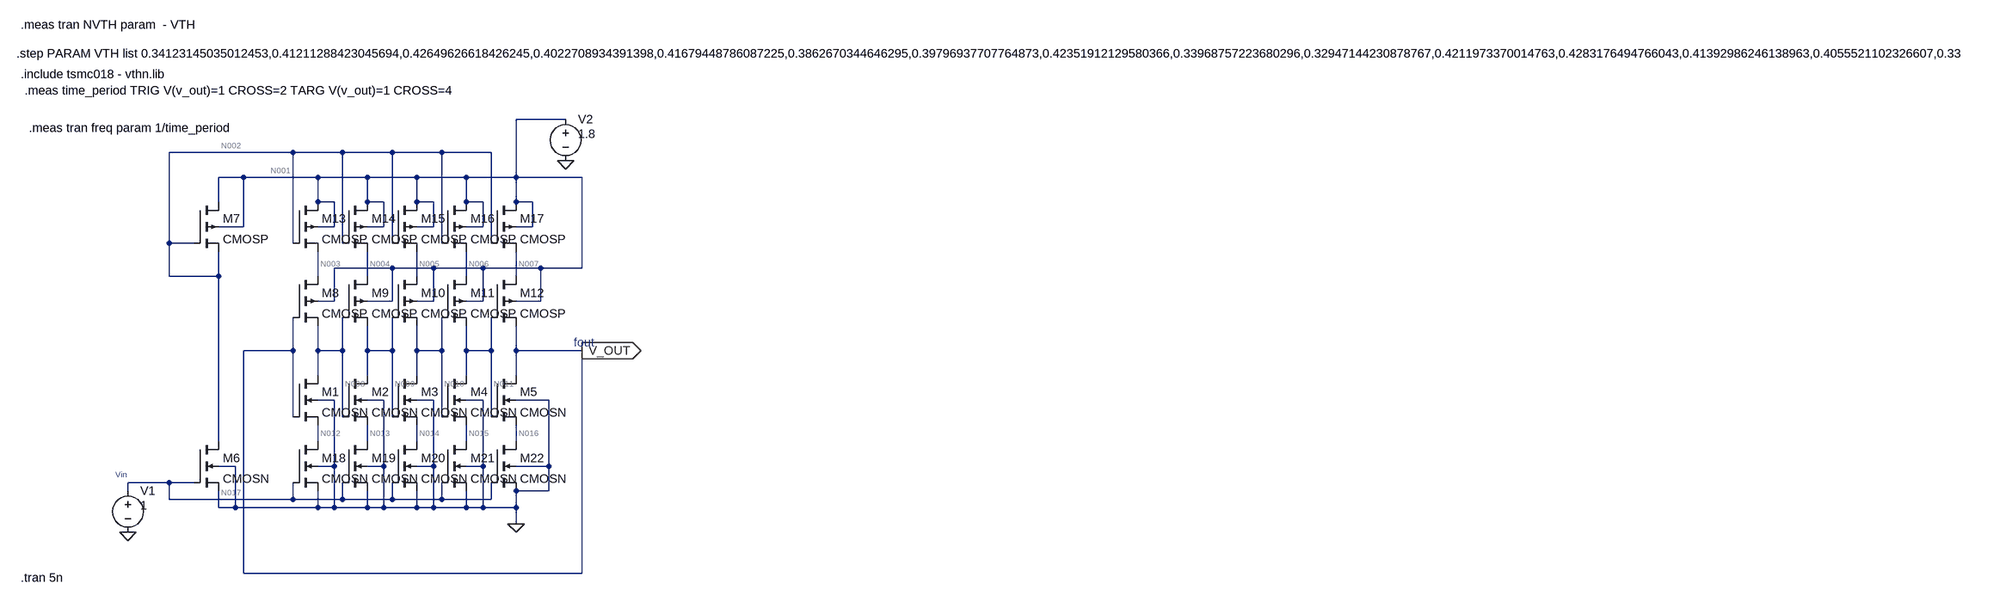
[diagram p0: schematic VCO_final.asc]
VCO_final.asc, the LTspice schematic file:
Version 4
SHEET 1 60540 720
WIRE 512 -288 416 -288
WIRE -16 -224 -256 -224
WIRE 80 -224 -16 -224
WIRE 176 -224 80 -224
WIRE 272 -224 176 -224
WIRE 368 -224 272 -224
WIRE -112 -176 -160 -176
WIRE 32 -176 -112 -176
WIRE 128 -176 32 -176
WIRE 224 -176 128 -176
WIRE 320 -176 224 -176
WIRE 416 -176 416 -288
WIRE 416 -176 320 -176
WIRE 544 -176 416 -176
WIRE -160 -128 -160 -176
WIRE 32 -128 32 -176
WIRE 64 -128 32 -128
WIRE 128 -128 128 -176
WIRE 160 -128 128 -128
WIRE 224 -128 224 -176
WIRE 256 -128 224 -128
WIRE 320 -128 320 -176
WIRE 352 -128 320 -128
WIRE 416 -128 416 -176
WIRE 448 -128 416 -128
WIRE -112 -80 -112 -176
WIRE -112 -80 -160 -80
WIRE 64 -80 64 -128
WIRE 64 -80 32 -80
WIRE 160 -80 160 -128
WIRE 160 -80 128 -80
WIRE 256 -80 256 -128
WIRE 256 -80 224 -80
WIRE 352 -80 352 -128
WIRE 352 -80 320 -80
WIRE 448 -80 448 -128
WIRE 448 -80 416 -80
WIRE -256 -48 -256 -224
WIRE -208 -48 -256 -48
WIRE -16 -48 -16 -224
WIRE 80 -48 80 -224
WIRE 176 -48 176 -224
WIRE 272 -48 272 -224
WIRE 368 -48 368 -224
WIRE 176 0 64 0
WIRE 256 0 176 0
WIRE 352 0 256 0
WIRE 464 0 352 0
WIRE 544 0 544 -176
WIRE 544 0 464 0
WIRE -256 16 -256 -48
WIRE -160 16 -160 -32
WIRE -160 16 -256 16
WIRE 32 16 32 -32
WIRE 128 16 128 -32
WIRE 224 16 224 -32
WIRE 320 16 320 -32
WIRE 416 16 416 -32
WIRE 64 64 64 0
WIRE 64 64 32 64
WIRE 176 64 176 0
WIRE 176 64 128 64
WIRE 256 64 256 0
WIRE 256 64 224 64
WIRE 352 64 352 0
WIRE 352 64 320 64
WIRE 464 64 464 0
WIRE 464 64 416 64
WIRE -16 160 -16 96
WIRE -16 160 -112 160
WIRE 32 160 32 112
WIRE 80 160 80 96
WIRE 80 160 32 160
WIRE 128 160 128 112
WIRE 176 160 176 96
WIRE 176 160 128 160
WIRE 224 160 224 112
WIRE 272 160 272 96
WIRE 272 160 224 160
WIRE 320 160 320 112
WIRE 368 160 368 96
WIRE 368 160 320 160
WIRE 416 160 416 112
WIRE 544 160 416 160
WIRE 32 208 32 160
WIRE 128 208 128 160
WIRE 224 208 224 160
WIRE 320 208 320 160
WIRE 416 208 416 160
WIRE 64 256 32 256
WIRE 160 256 128 256
WIRE 256 256 224 256
WIRE 352 256 320 256
WIRE 480 256 416 256
WIRE -16 288 -16 160
WIRE 80 288 80 160
WIRE 176 288 176 160
WIRE 272 288 272 160
WIRE 368 288 368 160
WIRE -160 336 -160 16
WIRE 32 336 32 304
WIRE 128 336 128 304
WIRE 224 336 224 304
WIRE 320 336 320 304
WIRE 416 336 416 304
WIRE -128 384 -160 384
WIRE 64 384 64 256
WIRE 64 384 32 384
WIRE 160 384 160 256
WIRE 160 384 128 384
WIRE 256 384 256 256
WIRE 256 384 224 384
WIRE 352 384 352 256
WIRE 352 384 320 384
WIRE 480 384 480 256
WIRE 480 384 416 384
WIRE -256 416 -336 416
WIRE -208 416 -256 416
WIRE -336 432 -336 416
WIRE 480 432 480 384
WIRE 480 432 416 432
WIRE -256 448 -256 416
WIRE -16 448 -16 416
WIRE -16 448 -256 448
WIRE 80 448 80 416
WIRE 80 448 -16 448
WIRE 176 448 176 416
WIRE 176 448 80 448
WIRE 272 448 272 416
WIRE 272 448 176 448
WIRE 368 448 368 416
WIRE 368 448 272 448
WIRE -160 464 -160 432
WIRE -128 464 -128 384
WIRE -128 464 -160 464
WIRE 32 464 32 432
WIRE 32 464 -128 464
WIRE 64 464 64 384
WIRE 64 464 32 464
WIRE 128 464 128 432
WIRE 128 464 64 464
WIRE 160 464 160 384
WIRE 160 464 128 464
WIRE 224 464 224 432
WIRE 224 464 160 464
WIRE 256 464 256 384
WIRE 256 464 224 464
WIRE 320 464 320 432
WIRE 320 464 256 464
WIRE 352 464 352 384
WIRE 352 464 320 464
WIRE 416 464 416 432
WIRE 416 464 352 464
WIRE 416 496 416 464
WIRE -112 592 -112 160
WIRE 544 592 544 160
WIRE 544 592 -112 592
FLAG 416 496 0
FLAG -336 512 0
FLAG 512 -208 0
FLAG 544 160 V_OUT
IOPIN 544 160 Out
SYMBOL cmosn -16 208 R0
SYMATTR InstName M1
SYMATTR Value2 l=180n w=400n
SYMBOL cmosn 80 208 R0
SYMATTR InstName M2
SYMATTR Value2 l=180n w=400n
SYMBOL cmosn 176 208 R0
SYMATTR InstName M3
SYMATTR Value2 l=180n w=400n
SYMBOL cmosn 272 208 R0
SYMATTR InstName M4
SYMATTR Value2 l=180n w=400n
SYMBOL cmosn 368 208 R0
SYMATTR InstName M5
SYMATTR Value2 l=180n w=400n
SYMBOL cmosn -208 336 R0
SYMATTR InstName M6
SYMATTR Value2 l=180n w=400n
SYMBOL cmosp -208 -128 R0
SYMATTR InstName M7
SYMATTR Value2 l=180n w=720n
SYMBOL cmosp -16 16 R0
SYMATTR InstName M8
SYMATTR Value2 l=180n w=720n
SYMBOL cmosp 80 16 R0
SYMATTR InstName M9
SYMATTR Value2 l=180n w=720n
SYMBOL cmosp 176 16 R0
SYMATTR InstName M10
SYMATTR Value2 l=180n w=720n
SYMBOL cmosp 272 16 R0
SYMATTR InstName M11
SYMATTR Value2 l=180n w=720n
SYMBOL cmosp 368 16 R0
SYMATTR InstName M12
SYMATTR Value2 l=180n w=720n
SYMBOL cmosp -16 -128 R0
SYMATTR InstName M13
SYMATTR Value2 l=180n w=720n
SYMBOL cmosp 80 -128 R0
SYMATTR InstName M14
SYMATTR Value2 l=180n w=720n
SYMBOL cmosp 176 -128 R0
SYMATTR InstName M15
SYMATTR Value2 l=180n w=720n
SYMBOL cmosp 272 -128 R0
SYMATTR InstName M16
SYMATTR Value2 l=180n w=720n
SYMBOL cmosp 368 -128 R0
SYMATTR InstName M17
SYMATTR Value2 l=180n w=720n
SYMBOL cmosn -16 336 R0
SYMATTR InstName M18
SYMATTR Value2 l=180n w=400n
SYMBOL cmosn 80 336 R0
SYMATTR InstName M19
SYMATTR Value2 l=180n w=400n
SYMBOL cmosn 176 336 R0
SYMATTR InstName M20
SYMATTR Value2 l=180n w=400n
SYMBOL cmosn 272 336 R0
SYMATTR InstName M21
SYMATTR Value2 l=180n w=400n
SYMBOL cmosn 368 336 R0
SYMATTR InstName M22
SYMATTR Value2 l=180n w=400n
SYMBOL voltage -336 416 R0
WINDOW 123 0 0 Left 0
WINDOW 39 0 0 Left 0
WINDOW 3 24 44 Left 2
SYMATTR Value 1
SYMATTR InstName V1
SYMBOL voltage 512 -304 R0
WINDOW 123 0 0 Left 0
WINDOW 39 0 0 Left 0
WINDOW 3 24 44 Left 2
SYMATTR Value 1.8
SYMATTR InstName V2
TEXT -360 400 Left 1 ;Vin
TEXT -544 -376 Left 2 !.include tsmc018 - vthn.lib
TEXT 528 144 Left 2 ;fout
TEXT -544 600 Left 2 !.tran 5n
TEXT -536 -344 Left 2 !.meas time_period TRIG V(v_out)=1 CROSS=2 TARG V(v_out)=1 CROSS=4
TEXT -528 -272 Left 2 !.meas tran freq param 1/time_period
TEXT -552 -416 Left 2 !.step PARAM VTH list 0.34123145035012453,0.41211288423045694,0.42649626618426245,0.4022708934391398,0.41679448786087225,0.3862670344646295,0.39796937707764873,0.42351912129580366,0.33968757223680296,0.32947144230878767,0.4211973370014763,0.4283176494766043,0.41392986246138963,0.4055521102326607,0.3344496518028196,0.3657123658260539,0.34614992494358454,0.3964107297443898,0.41024549929109094,0.3648597717710239,0.34522579887786636,0.404847386598565,0.37460345053578714,0.42921464622789285,0.3772612651016478,0.4161702052802685,0.36600139049304814,0.41908511931473874,0.40927036845522574,0.3631414978111844,0.348054698184029,0.3558470532014468,0.43816164310341166,0.43904430614803064,0.3920947131348672,0.43576638461181516,0.3725080336835615,0.4105138459687793,0.35863793990781917,0.4423548387084376,0.42070040486412613,0.3674810891098386,0.41314563117988473,0.40219142324970547,0.39721959746376534,0.41184450646851484,0.3529392884662512,0.39939314953899596,0.3764285631359052,0.42469374750574496,0.38628267011991163,0.4430167249331012,0.33727633609166197,0.41343349153926306,0.35148275458146505,0.4001497092096314,0.4713983979675836,0.38135091221781425,0.3723307534587298,0.37301852708525574,0.33320564019381643,0.4102736127128648,0.3184868129197651,0.3833000598738273,0.45643126076383045,0.405794505600391,0.3936318548533926,0.463109531846861,0.46249498340604484,0.3762165369904304,0.37688124433454795,0.4011519754923409,0.37765600990409953,0.43681384689065056,0.4255514089770617,0.45256370497813914,0.4166905175462833,0.3368445789803969,0.3924425163729591,0.43620625444145833,0.3815431335926527,0.32485246910000376,0.37238436652416246,0.4197542600307912,0.37382602326897474,0.423340221221321,0.3837018101919968,0.39051683308038254,0.4532311036347836,0.39662051199745296,0.40124538404153315,0.4086491032540003,0.3688441243631652,0.4325105480018463,0.39677801399992074,0.4112788463423556,0.4944176386371289,0.3749279344176446,0.3080620381482138,0.36518813592270644,0.42471037451196114,0.38487323328131895,0.35232562759257263,0.420358414656914,0.38418245693136804,0.3611101564381721,0.49107852153747544,0.37177656798760156,0.3804654123151989,0.3660581763651771,0.42128526051740606,0.38548177025650804,0.34387803352337165,0.45404984689034716,0.4222415081737018,0.4313853194269319,0.3554055479435352,0.36851148978690307,0.4171475638855737,0.37098037028639763,0.34476902249925784,0.3977539477988256,0.3479771662452767,0.4358790657900633,0.4144323581835056,0.3538197319094376,0.4131307279731286,0.41528962138818953,0.40632022359474024,0.44035433986726663,0.3650305759067878,0.35408169191803424,0.40641080008659336,0.3725902793941234,0.40759294263324086,0.4562114387339081,0.4078138915212504,0.3981679488532111,0.4063669183272805,0.39781852353741376,0.39575882256583134,0.42809945732132265,0.3959886146373276,0.3589556374780292,0.35091671925222384,0.41728146173695546,0.3542802170682952,0.3908407828604423,0.3760077333557209,0.40628197349912426,0.3839458277006042,0.38946649047323556,0.39540742123569467,0.40251430666052873,0.3797940165578701,0.43308684158186495,0.2778500785714441,0.37223399650821487,0.37503460256099835,0.3983597932957826,0.4216801084842382,0.3352102821653071,0.41503155510277,0.37344480560627136,0.4238235964857379,0.3921225278547601,0.3964489812498269,0.33806797341778916,0.3918770429000265,0.4997326545299706,0.3780714823066963,0.347517731873477,0.397169569671728,0.34822611939145465,0.41336025516607655,0.4552249514742054,0.45621058556221405,0.3896944750691362,0.36600044168859097,0.4287016626999486,0.4271690708099927,0.40501562810085107,0.401577427651368,0.42823651486995584,0.35121895394048347,0.37177467869890624,0.3372763927011097,0.4001796243790737,0.41495924616882346,0.4291356450453868,0.33600135197395603,0.3248539043657599,0.39957084242810414,0.3965284910215623,0.3958331478953597,0.4058255506685828,0.42740318040180236,0.3629473429174722,0.4413177749838848,0.3510178966466979
TEXT -544 -472 Left 2 !.meas tran NVTH param  - VTH

The netlist it stands for:
* VCO_final.asc
M1 N008 V_OUT N012 0 CMOSN l=180n w=400n
M2 N009 N008 N013 0 CMOSN l=180n w=400n
M3 N010 N009 N014 0 CMOSN l=180n w=400n
M4 N011 N010 N015 0 CMOSN l=180n w=400n
M5 V_OUT N011 N016 0 CMOSN l=180n w=400n
M6 N002 N017 0 0 CMOSN l=180n w=400n
M7 N001 N002 N002 N001 CMOSP l=180n w=720n
M8 N003 V_OUT N008 N001 CMOSP l=180n w=720n
M9 N004 N008 N009 N001 CMOSP l=180n w=720n
M10 N005 N009 N010 N001 CMOSP l=180n w=720n
M11 N006 N010 N011 N001 CMOSP l=180n w=720n
M12 N007 N011 V_OUT N001 CMOSP l=180n w=720n
M13 N001 N002 N003 N001 CMOSP l=180n w=720n
M14 N001 N002 N004 N001 CMOSP l=180n w=720n
M15 N001 N002 N005 N001 CMOSP l=180n w=720n
M16 N001 N002 N006 N001 CMOSP l=180n w=720n
M17 N001 N002 N007 N001 CMOSP l=180n w=720n
M18 N012 N017 0 0 CMOSN l=180n w=400n
M19 N013 N017 0 0 CMOSN l=180n w=400n
M20 N014 N017 0 0 CMOSN l=180n w=400n
M21 N015 N017 0 0 CMOSN l=180n w=400n
M22 N016 N017 0 0 CMOSN l=180n w=400n
V1 N017 0 1
V2 N001 0 1.8
.model NMOS NMOS
.model PMOS PMOS
.lib standard.mos
* Vin
.include tsmc018 - vthn.lib
* fout
.tran 5n
.meas time_period TRIG V(v_out)=1 CROSS=2 TARG V(v_out)=1 CROSS=4
.meas tran freq param 1/time_period
.step PARAM VTH list 0.34123145035012453,0.41211288423045694,0.42649626618426245,0.4022708934391398,0.41679448786087225,0.3862670344646295,0.39796937707764873,0.42351912129580366,0.33968757223680296,0.32947144230878767,0.4211973370014763,0.4283176494766043,0.41392986246138963,0.4055521102326607,0.3344496518028196,0.3657123658260539,0.34614992494358454,0.3964107297443898,0.41024549929109094,0.3648597717710239,0.34522579887786636,0.404847386598565,0.37460345053578714,0.42921464622789285,0.3772612651016478,0.4161702052802685,0.36600139049304814,0.41908511931473874,0.40927036845522574,0.3631414978111844,0.348054698184029,0.3558470532014468,0.43816164310341166,0.43904430614803064,0.3920947131348672,0.43576638461181516,0.3725080336835615,0.4105138459687793,0.35863793990781917,0.4423548387084376,0.42070040486412613,0.3674810891098386,0.41314563117988473,0.40219142324970547,0.39721959746376534,0.41184450646851484,0.3529392884662512,0.39939314953899596,0.3764285631359052,0.42469374750574496,0.38628267011991163,0.4430167249331012,0.33727633609166197,0.41343349153926306,0.35148275458146505,0.4001497092096314,0.4713983979675836,0.38135091221781425,0.3723307534587298,0.37301852708525574,0.33320564019381643,0.4102736127128648,0.3184868129197651,0.3833000598738273,0.45643126076383045,0.405794505600391,0.3936318548533926,0.463109531846861,0.46249498340604484,0.3762165369904304,0.37688124433454795,0.4011519754923409,0.37765600990409953,0.43681384689065056,0.4255514089770617,0.45256370497813914,0.4166905175462833,0.3368445789803969,0.3924425163729591,0.43620625444145833,0.3815431335926527,0.32485246910000376,0.37238436652416246,0.4197542600307912,0.37382602326897474,0.423340221221321,0.3837018101919968,0.39051683308038254,0.4532311036347836,0.39662051199745296,0.40124538404153315,0.4086491032540003,0.3688441243631652,0.4325105480018463,0.39677801399992074,0.4112788463423556,0.4944176386371289,0.3749279344176446,0.3080620381482138,0.36518813592270644,0.42471037451196114,0.38487323328131895,0.35232562759257263,0.420358414656914,0.38418245693136804,0.3611101564381721,0.49107852153747544,0.37177656798760156,0.3804654123151989,0.3660581763651771,0.42128526051740606,0.38548177025650804,0.34387803352337165,0.45404984689034716,0.4222415081737018,0.4313853194269319,0.3554055479435352,0.36851148978690307,0.4171475638855737,0.37098037028639763,0.34476902249925784,0.3977539477988256,0.3479771662452767,0.4358790657900633,0.4144323581835056,0.3538197319094376,0.4131307279731286,0.41528962138818953,0.40632022359474024,0.44035433986726663,0.3650305759067878,0.35408169191803424,0.40641080008659336,0.3725902793941234,0.40759294263324086,0.4562114387339081,0.4078138915212504,0.3981679488532111,0.4063669183272805,0.39781852353741376,0.39575882256583134,0.42809945732132265,0.3959886146373276,0.3589556374780292,0.35091671925222384,0.41728146173695546,0.3542802170682952,0.3908407828604423,0.3760077333557209,0.40628197349912426,0.3839458277006042,0.38946649047323556,0.39540742123569467,0.40251430666052873,0.3797940165578701,0.43308684158186495,0.2778500785714441,0.37223399650821487,0.37503460256099835,0.3983597932957826,0.4216801084842382,0.3352102821653071,0.41503155510277,0.37344480560627136,0.4238235964857379,0.3921225278547601,0.3964489812498269,0.33806797341778916,0.3918770429000265,0.4997326545299706,0.3780714823066963,0.347517731873477,0.397169569671728,0.34822611939145465,0.41336025516607655,0.4552249514742054,0.45621058556221405,0.3896944750691362,0.36600044168859097,0.4287016626999486,0.4271690708099927,0.40501562810085107,0.401577427651368,0.42823651486995584,0.35121895394048347,0.37177467869890624,0.3372763927011097,0.4001796243790737,0.41495924616882346,0.4291356450453868,0.33600135197395603,0.3248539043657599,0.39957084242810414,0.3965284910215623,0.3958331478953597,0.4058255506685828,0.42740318040180236,0.3629473429174722,0.4413177749838848,0.3510178966466979
.meas tran NVTH param  - VTH
.backanno
.end

* Results of the author's LTspice run, read from the files saved beside the schematic
* Operating Point (first step), zero values left out:
*   vth = 277.9 m
*   V(n008) = 719.8 mV
*   V(v_out) = 719.8 mV
*   V(n012) = 66.83 mV
*   V(n009) = 719.8 mV
*   V(n013) = 66.83 mV
*   V(n010) = 719.8 mV
*   V(n014) = 66.83 mV
*   V(n011) = 719.8 mV
*   V(n015) = 66.83 mV
*   V(n016) = 66.83 mV
*   V(n002) = 458.7 mV
*   V(n017) = 1 V
*   V(n001) = 1.8 V
*   V(n003) = 1.666 V
*   V(n004) = 1.666 V
*   V(n005) = 1.666 V
*   V(n006) = 1.666 V
*   V(n007) = 1.666 V
*   Id(M17) = 31.91 µA
*   Is(M17) = -31.91 µA
*   Id(M16) = 31.91 µA
*   Is(M16) = -31.91 µA
*   Id(M15) = 31.91 µA
*   Is(M15) = -31.91 µA
*   Id(M14) = 31.91 µA
*   Is(M14) = -31.91 µA
*   Id(M13) = 31.91 µA
*   Is(M13) = -31.91 µA
*   Id(M12) = 31.91 µA
*   Ib(M12) = 1.234 pA
*   Is(M12) = -31.91 µA
*   Id(M11) = 31.91 µA
*   Ib(M11) = 1.234 pA
*   Is(M11) = -31.91 µA
*   Id(M10) = 31.91 µA
*   Ib(M10) = 1.234 pA
*   Is(M10) = -31.91 µA
*   Id(M9) = 31.91 µA
*   Ib(M9) = 1.234 pA
*   Is(M9) = -31.91 µA
*   Id(M8) = 31.91 µA
*   Ib(M8) = 1.234 pA
*   Is(M8) = -31.91 µA
*   Id(M7) = 104.1 µA
*   Ib(M7) = 1.351 pA
*   Is(M7) = -104.1 µA
*   Id(M22) = 31.91 µA
*   Is(M22) = -31.91 µA
*   Id(M21) = 31.91 µA
*   Is(M21) = -31.91 µA
*   Id(M20) = 31.91 µA
*   Is(M20) = -31.91 µA
*   Id(M19) = 31.91 µA
*   Is(M19) = -31.91 µA
*   Id(M18) = 31.91 µA
*   Is(M18) = -31.91 µA
*   Id(M6) = 104.1 µA
*   Is(M6) = -104.1 µA
*   Id(M5) = 31.91 µA
*   Is(M5) = -31.91 µA
*   Id(M4) = 31.91 µA
*   Is(M4) = -31.91 µA
*   Id(M3) = 31.91 µA
*   Is(M3) = -31.91 µA
*   Id(M2) = 31.91 µA
*   Is(M2) = -31.91 µA
*   Id(M1) = 31.91 µA
*   Is(M1) = -31.91 µA
*   I(V2) = -263.7 µA
* From the log:
*   Measurement: time_period
*     step  time_period  FROM  TO
*        1  5.46032e-010  9.78402e-010  1.52443e-009
*        2  5.69848e-010  1.03753e-009  1.60738e-009
*        3  5.78819e-010  1.07638e-009  1.6552e-009
*        4  5.77069e-010  7.72967e-010  1.35004e-009
*        5  5.84495e-010  1.32978e-009  1.91427e-009
*        6  5.8872e-010  1.19882e-009  1.78754e-009
*        7  5.92215e-010  1.06871e-009  1.66093e-009
*        8  5.93346e-010  1.0246e-009  1.61795e-009
*        9  5.87665e-010  7.85811e-010  1.37348e-009
*       10  5.94871e-010  1.26643e-009  1.86131e-009
*       11  5.95672e-010  1.08781e-009  1.68349e-009
*       12  5.9609e-010  1.22202e-009  1.81811e-009
*       13  5.91925e-010  7.99111e-010  1.39104e-009
*       14  5.96841e-010  1.06324e-009  1.66008e-009
*       15  5.96316e-010  9.53593e-010  1.54991e-009
*       16  5.93485e-010  7.90638e-010  1.38412e-009
*       17  6.02508e-010  1.0649e-009  1.66741e-009
*       18  6.03405e-010  1.33913e-009  1.94253e-009
*       19  5.97413e-010  7.93841e-010  1.39125e-009
*       20  6.04763e-010  1.05631e-009  1.66107e-009
*       21  6.06153e-010  1.091e-009  1.69715e-009
*       22  5.99384e-010  7.92766e-010  1.39215e-009
*       23  6.06703e-010  1.07938e-009  1.68609e-009
*       24  6.06872e-010  1.09548e-009  1.70236e-009
*       25  6.09358e-010  1.00949e-009  1.61884e-009
*       26  6.09717e-010  1.37172e-009  1.98144e-009
*       27  6.09766e-010  1.01952e-009  1.62929e-009
*       28  6.10201e-010  1.35045e-009  1.96065e-009
*       29  6.11059e-010  1.28631e-009  1.89737e-009
*       30  6.11682e-010  1.11631e-009  1.72799e-009
*       31  6.12577e-010  1.06101e-009  1.67359e-009
*       32  6.12868e-010  1.08019e-009  1.69306e-009
*       33  6.03736e-010  7.83189e-010  1.38692e-009
*       34  6.14247e-010  1.0777e-009  1.69195e-009
*       35  6.14723e-010  1.34831e-009  1.96303e-009
*       36  6.08371e-010  7.90851e-010  1.39922e-009
*       37  6.15859e-010  8.32494e-010  1.44835e-009
*       38  6.13001e-010  8.03665e-010  1.41667e-009
*       39  6.19016e-010  8.26143e-010  1.44516e-009
*       40  6.17495e-010  8.15921e-010  1.43342e-009
*     ...
*   Measurement: freq
*     step  1/time_period
*        1  1.83139e+009
*        2  1.75486e+009
*        3  1.72766e+009
*        4  1.7329e+009
*        5  1.71088e+009
*        6  1.6986e+009
*        7  1.68857e+009
*        8  1.68536e+009
*        9  1.70165e+009
*       10  1.68104e+009
*       11  1.67878e+009
*       12  1.6776e+009
*       13  1.6894e+009
*       14  1.67549e+009
*       15  1.67696e+009
*       16  1.68496e+009
*       17  1.65973e+009
*       18  1.65726e+009
*       19  1.67388e+009
*       20  1.65354e+009
*       21  1.64975e+009
*       22  1.66838e+009
*       23  1.64825e+009
*       24  1.64779e+009
*       25  1.64107e+009
*       26  1.64011e+009
*       27  1.63997e+009
*       28  1.6388e+009
*       29  1.6365e+009
*       30  1.63484e+009
*       31  1.63245e+009
*       32  1.63167e+009
*       33  1.65635e+009
*       34  1.62801e+009
*       35  1.62675e+009
*       36  1.64373e+009
*       37  1.62375e+009
*       38  1.63132e+009
*       39  1.61547e+009
*       40  1.61945e+009
*     ...
*   Measurement: nvth
*     step  - vth
*        1  -0.27785
*        2  -0.308062
*        3  -0.318487
*        4  -0.324852
*        5  -0.324854
*        6  -0.329471
*        7  -0.333206
*        8  -0.33445
*        9  -0.33521
*       10  -0.336001
*       11  -0.336845
*       12  -0.337276
*       13  -0.337276
*       14  -0.338068
*       15  -0.339688
*       16  -0.341231
*       17  -0.343878
*       18  -0.344769
*       19  -0.345226
*       20  -0.34615
*       21  -0.347518
*       22  -0.347977
*       23  -0.348055
*       24  -0.348226
*       25  -0.350917
*       26  -0.351018
*       27  -0.351219
*       28  -0.351483
*       29  -0.352326
*       30  -0.352939
*       31  -0.35382
*       32  -0.354082
*       33  -0.35428
*       34  -0.355406
*       35  -0.355847
*       36  -0.358638
*       37  -0.358956
*       38  -0.36111
*       39  -0.362947
*       40  -0.363141
*     ...